# EAGLE design alfie2 (EAGLE 6.4)
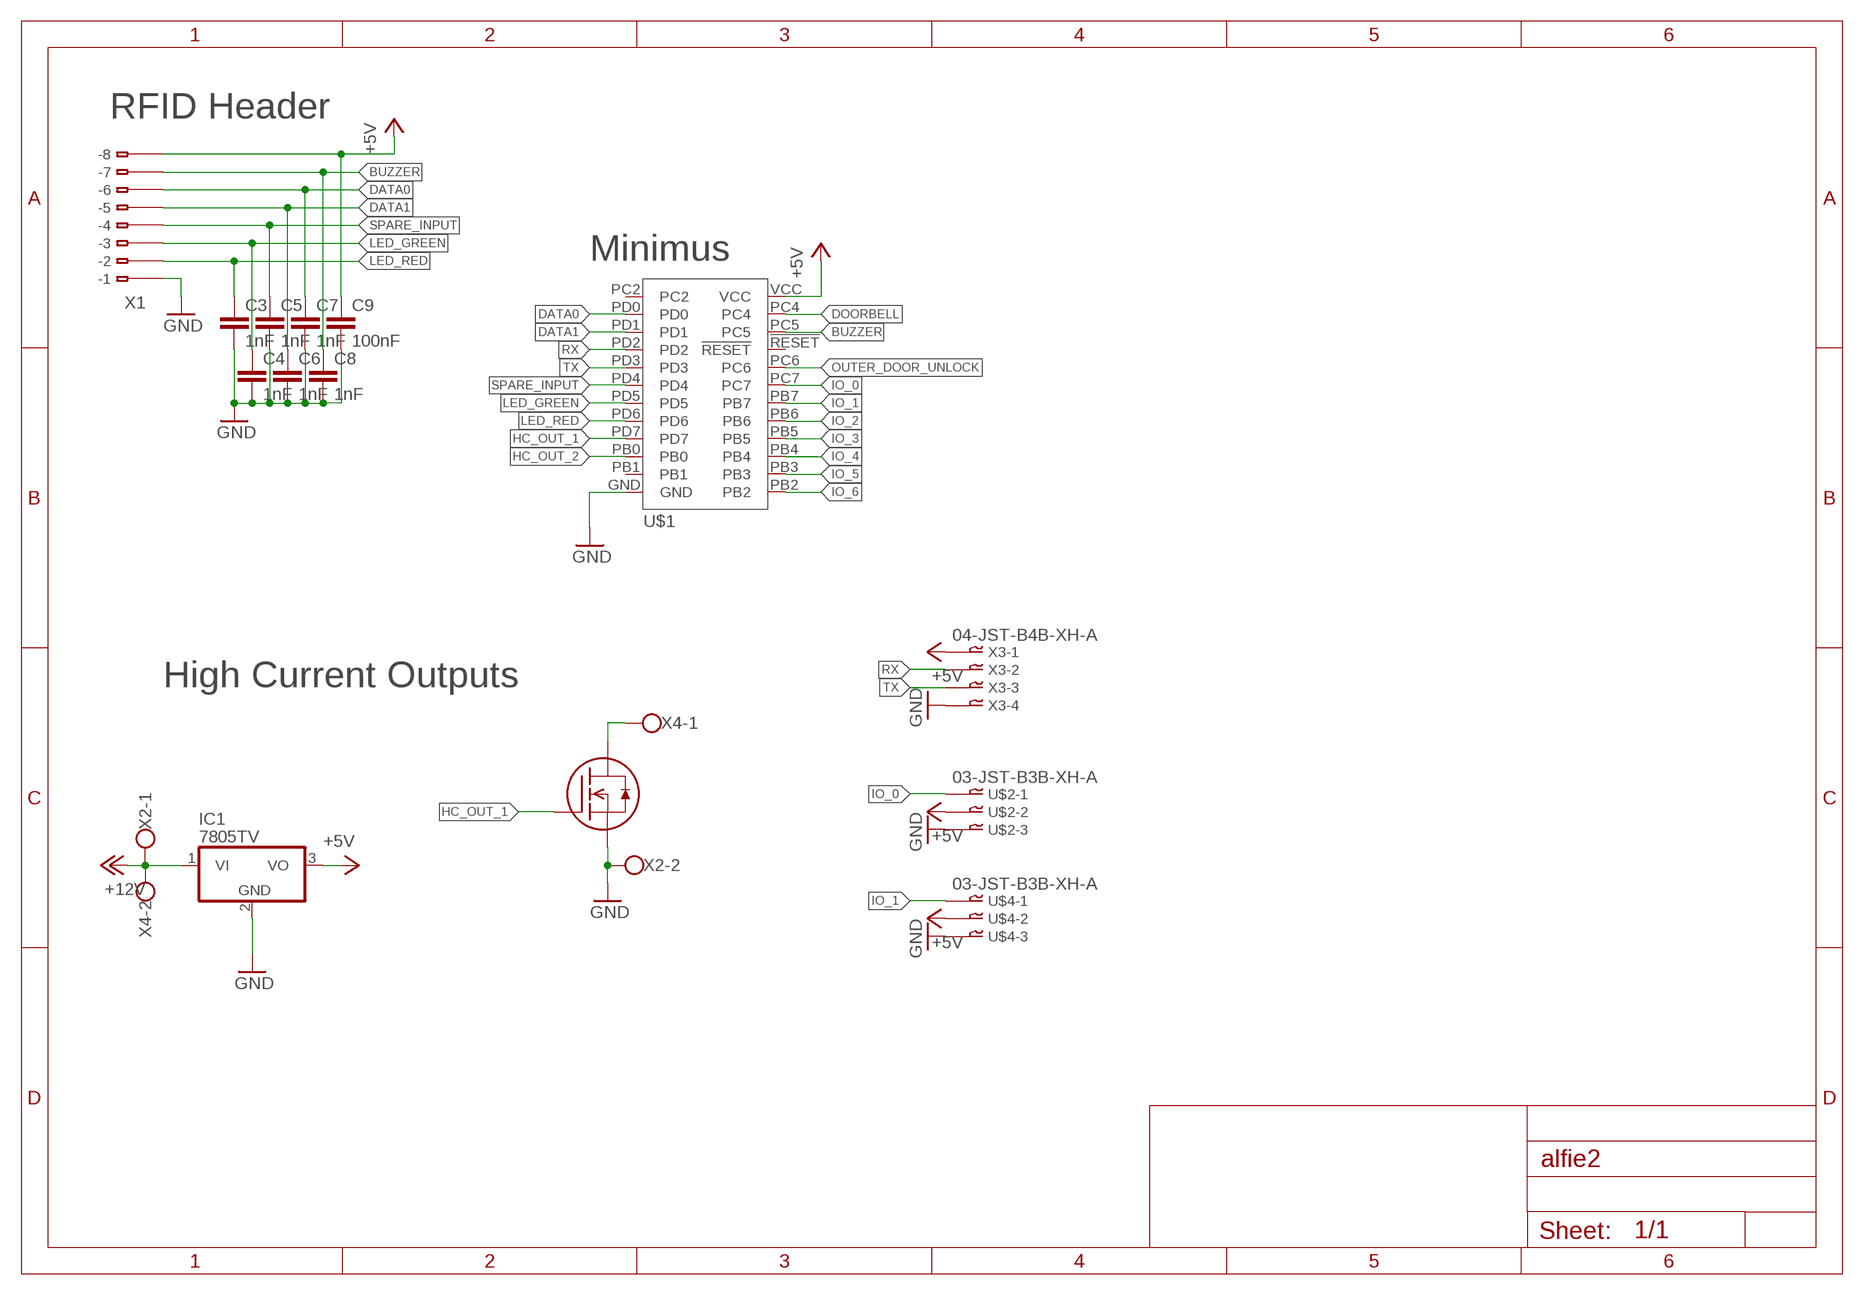
[diagram p0: schematic, sheet 1]

## Parts
C3  1nF  C-EUC0805  [C0805]
C4  1nF  C-EUC0805  [C0805]
C5  1nF  C-EUC0805  [C0805]
C6  1nF  C-EUC0805  [C0805]
C7  1nF  C-EUC0805  [C0805]
C8  1nF  C-EUC0805  [C0805]
C9  100nF  C-EUC0805  [C0805]
IC1  7805TV  [TO220V]
U$1  MINIMUS  [MINIMUS]
U$2  03-JST-B3B-XH-A  [B3B-XH]
U$3  NTF3055L108T1GTAB  [SOT223]
U$4  03-JST-B3B-XH-A  [B3B-XH]
X1  233-508  [233-508]
X2  W237-102  [W237-102]
X3  04-JST-B4B-XH-A  [B4B-XH]
X4  W237-102  [W237-102]

## Nets
+5V: C9.1 IC1.3(VO) U$1.VCC U$2.P$2 U$4.P$2 X1.B8(B-8) X3.P$1
+12V: IC1.1(VI) X2.1 X4.2
BUZZER: C8.1 U$1.PC5 X1.B7(B-7)
DATA0: C7.1 U$1.PD0 X1.B6(B-6)
DATA1: C6.1 U$1.PD1 X1.B5(B-5)
DOORBELL: U$1.PC4
GND: C3.2 C4.2 C5.2 C6.2 C7.2 C8.2 C9.2 IC1.2(GND) U$1.GND U$2.P$3 U$3.3(S) U$4.P$3 X1.B1(B-1) X2.2 X3.P$4
HC_OUT_1: U$1.PD7 U$3.1(G)
HC_OUT_2: U$1.PB0
IO_0: U$1.PC7 U$2.P$1
IO_1: U$1.PB7 U$4.P$1
IO_2: U$1.PB6
IO_3: U$1.PB5
IO_4: U$1.PB4
IO_5: U$1.PB3
IO_6: U$1.PB2
LED_GREEN: C4.1 U$1.PD5 X1.B3(B-3)
LED_RED: C3.1 U$1.PD6 X1.B2(B-2)
N$5: U$3.4(D) X4.1
OUTER_DOOR_UNLOCK: U$1.PC6
RX: U$1.PD2 X3.P$2
SPARE_INPUT: C5.1 U$1.PD4 X1.B4(B-4)
TX: U$1.PD3 X3.P$3
Unconnected: U$1.!RESET U$1.PB1 U$1.PC2 X1.A1(-1) X1.A2(-2) X1.A3(-3) X1.A4(-4) X1.A5(-5) X1.A6(-6) X1.A7(-7) X1.A8(-8)

## Notes on the sheet
- RFID Header
- Minimus
- High Current Outputs

## Library data of the parts
C3-C9 = rcl:C-EU: CAPACITOR, European symbol
IC1 = linear:78*: Positive VOLTAGE REGULATOR Source: http://cache.national.com/ds/LM/LM78L05.pdf http://www.fairchildsemi.com/ds/LM/LM7805.pdf
U$1 = minimus:MINIMUS
U$2 U$4 = con-jst-xh:03-JST: JST CONNECTOR
U$3 = NTF3055L108:NTF3055L108T1G: Power MOSFET 3.0 A, 60 V, Logic Level, N?Channel SOT?223 Designed for low voltage, high speed switching applications in power supplies, converters and power motor controls and bridge circuits
X1 = con-wago:233-508: WAGO Cage Clamp; MF: Wago Corporation; MPN: 0233-0508; OC_FARNELL: 1777101; OC_NEWARK: 79K2053
X2 X4 = con-wago-500:W237-102: WAGO SCREW CLAMP; MPN: 237-102; OC_FARNELL: unknown; OC_NEWARK: 70K9898
X3 = con-jst-xh:04-JST: JST CONNECTOR

## Board
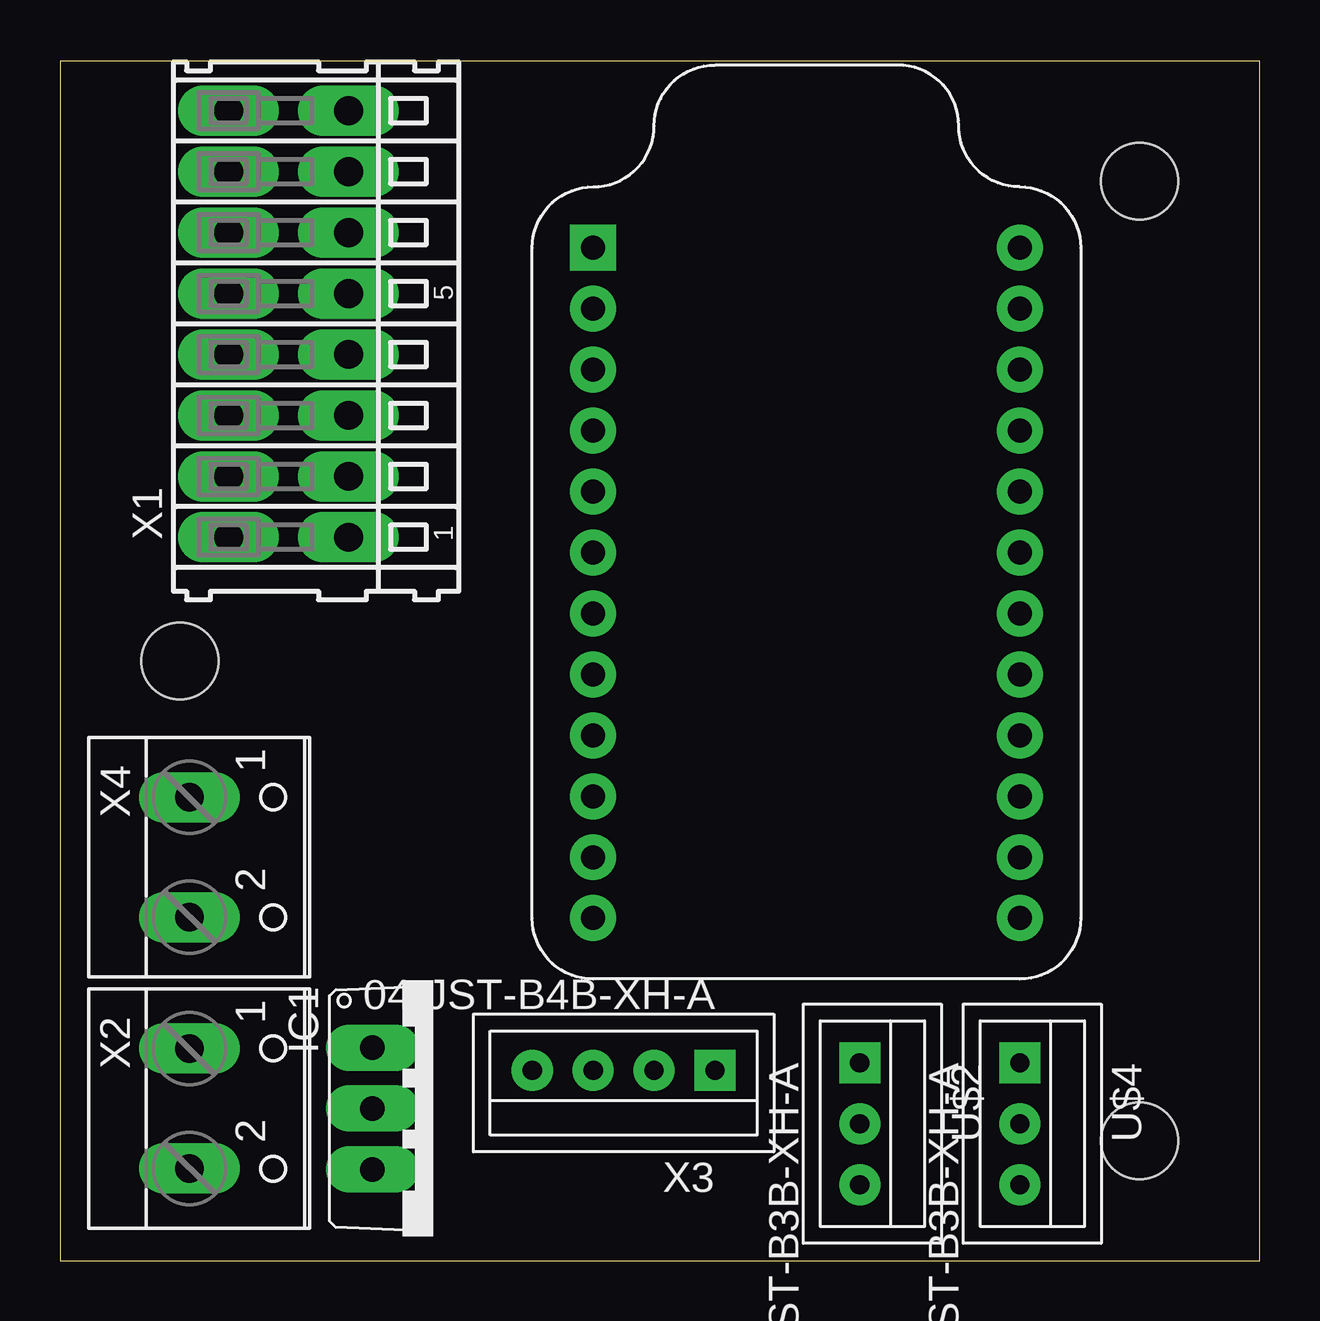
[diagram p1: board, top side]
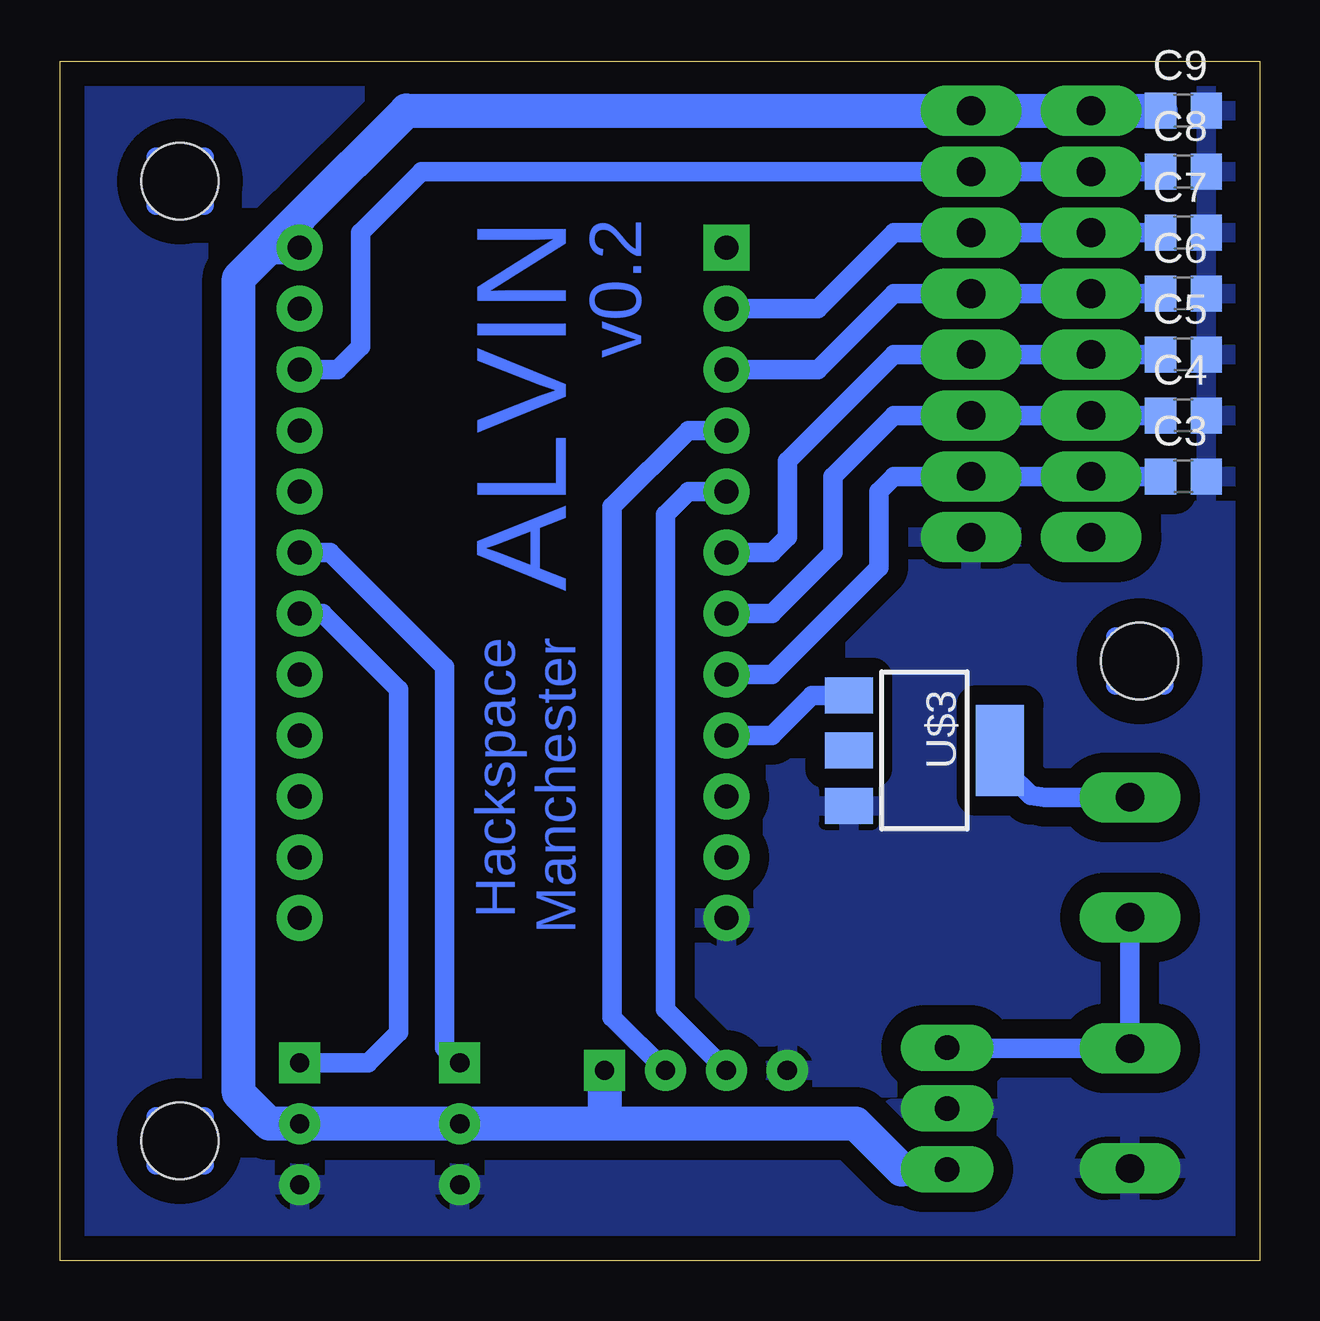
[diagram p2: board, bottom side, seen from below]

Size 50 x 50 mm. Coordinates in mm from the lower left corner, seen from the top.
Outline: 0,0 50,0 50,50 0,50 0,0
Copper layers (1*16): Top 0.035mm / dielectric 1.5mm / Bottom 0.035mm
Design rules "default": minimum track width 10mil, minimum drill 0.8mm, track to track 8mil, track to pad 8mil, pad to pad 8mil, via to via 8mil, smd to smd 8mil, copper to edge 40mil, drill to drill 8mil, minimum pad ring 18mil, minimum via ring 8mil, stop-mask expansion 4mil, vias tented up to drill 0mil, thermal gap 10mil
Holes 3.2 mm at 5,25 45,45 45,5

### Footprints (pad centres in the part's own frame; a part is rotated, then mirrored left to right if it is on the bottom)
C0805 = smd 1.3 x 1.5: 1 -0.95,0; 2 0.95,0
TO220V = drill 1.016 long: 1 -2.54,-2.54; 2 0,-2.54; 3 2.54,-2.54
MINIMUS = drill 1: !RESET 17.78,-7.62; GND 0,-27.94; PB0 0,-22.86; PB1 0,-25.4; PB2 17.78,-27.94; PB3 17.78,-25.4; PB4 17.78,-22.86; PB5 17.78,-20.32; PB6 17.78,-17.78; PB7 17.78,-15.24; PC4 17.78,-2.54; PC5 17.78,-5.08; PC6 17.78,-10.16; PC7 17.78,-12.7; PD0 0,-2.54; PD1 0,-5.08; PD2 0,-7.62; PD3 0,-10.16; PD4 0,-12.7; PD5 0,-15.24; PD6 0,-17.78; PD7 0,-20.32; VCC 17.78,0 | drill 1 square: PC2 0,0
B3B-XH = drill 0.8 square: P$1 -2.54,0 | drill 0.8: P$2 0,0; P$3 2.54,0
SOT223 = smd 1.5 x 2: 1 -2.3,-3.15; 2 0,-3.15; 3 2.3,-3.15 | smd 3.8 x 2: 4 0,3.15
233-508 = drill 1.2 long: A1 -8.89,2.5; A2 -6.35,2.5; A3 -3.81,2.5; A4 -1.27,2.5; A5 1.27,2.5; A6 3.81,2.5; A7 6.35,2.5; A8 8.89,2.5; B1 -8.89,-2.5; B2 -6.35,-2.5; B3 -3.81,-2.5; B4 -1.27,-2.5; B5 1.27,-2.5; B6 3.81,-2.5; B7 6.35,-2.5; B8 8.89,-2.5
W237-102 = drill 1.194 long: 1 -2.5,-1.27; 2 2.5,-1.27
B4B-XH = drill 0.8 square: P$1 -3.81,0 | drill 0.8: P$2 -1.27,0; P$3 1.27,0; P$4 3.81,0

### Placement (x,y rotation side)
C3  3.17,32.7 0 bottom
C4  3.17,35.24 0 bottom
C5  3.17,37.78 0 bottom
C6  3.17,40.32 0 bottom
C7  3.17,42.86 0 bottom
C8  3.17,45.4 0 bottom
C9  3.17,47.94 0 bottom
IC1  15.56,6.35 270 top
U$1  22.23,42.23 0 top
U$2  33.34,5.71 270 top
U$3  13.97,21.27 270 bottom
U$4  40.01,5.71 270 top
X1  9.53,39.05 90 top
X2  6.67,6.35 270 top
X3  23.5,7.94 180 top
X4  6.67,16.83 270 top

### Tracks (layer width: path | path; a pad name or v marks a point on that pad's centre or on a via)
+5V
  Bottom 0.813: U$1.VCC 40.01,43.5
  Bottom 1.422: C9.1 X1.B8 35.56,47.94 40.01,43.5 41.27,42.23 | 41.27,42.23 42.55,40.96 42.55,6.99 41.27,5.71 U$4.P$2 U$2.P$2 27.3,5.71 | U$1.VCC 41.27,42.23 | 27.3,5.71 16.83,5.71 14.92,3.81 IC1.3 | X3.P$1 27.3,5.71
+12V
  Bottom 0.813: X4.2 X2.1 12.98,8.85 IC1.1
BUZZER
  Bottom 0.813: U$1.PC5 38.42,37.15 37.47,38.1 37.47,42.86 34.92,45.4 X1.B7 C8.1
DATA0
  Bottom 0.813: C7.1 X1.B6 15.24,42.86 18.41,39.69 U$1.PD0
DATA1
  Bottom 0.813: C6.1 X1.B5 15.24,40.32 18.41,37.15 U$1.PD1
GND
  pour Bottom (isolate 0.813): -4.37,54.76 97.78,50 97.78,-5 -5,-5
HC_OUT_1
  Bottom 0.813: U$1.PD7 20.32,21.91 18.66,23.57 U$3.1
IO_0
  Bottom 0.813: U$1.PC7 38.73,29.53 33.97,24.77 33.97,8.89 U$2.P$1
IO_1
  Bottom 0.813: U$1.PB7 39.05,26.99 35.88,23.81 35.88,9.53 37.15,8.26 U$4.P$1
LED_GREEN
  Bottom 0.813: C4.1 X1.B3 15.24,35.24 17.78,32.7 17.78,29.53 20.32,26.99 U$1.PD5
LED_RED
  Bottom 0.813: C3.1 X1.B2 15.24,32.7 15.88,32.07 15.88,28.89 20.32,24.45 U$1.PD6
N$1  (via drill 1)
  Bottom 0.813: 4,26 v5,25 | v5,25 6,24 | 6,26 v5,25 | v5,25 4,24
N$3  (via drill 1)
  Bottom 0.813: 46,46 v45,45 | v45,45 44,44 | 44,46 v45,45 | v45,45 46,44
N$5
  Bottom 0.813: U$3.4 10.48,20.32 9.53,19.39 8.96,19.33 X4.1
N$6  (via drill 1)
  Bottom 0.813: 44,6 v45,5 | v45,5 46,4 | 46,6 v45,5 | v45,5 44,4
RX
  Bottom 0.813: U$1.PD2 23.81,34.61 26.99,31.43 26.99,10.16 X3.P$2
SPARE_INPUT
  Bottom 0.813: C5.1 X1.B4 15.24,37.78 19.68,33.34 19.68,30.16 20.32,29.53 U$1.PD4
TX
  Bottom 0.813: U$1.PD3 23.81,32.07 24.77,31.11 24.77,10.48 X3.P$3

### Text on the board
Bottom: v0.2 | ALVIN | Hackspace / Manchester